# EAGLE design Motor (EAGLE 9.7.0)

## Sheet 1 of 2
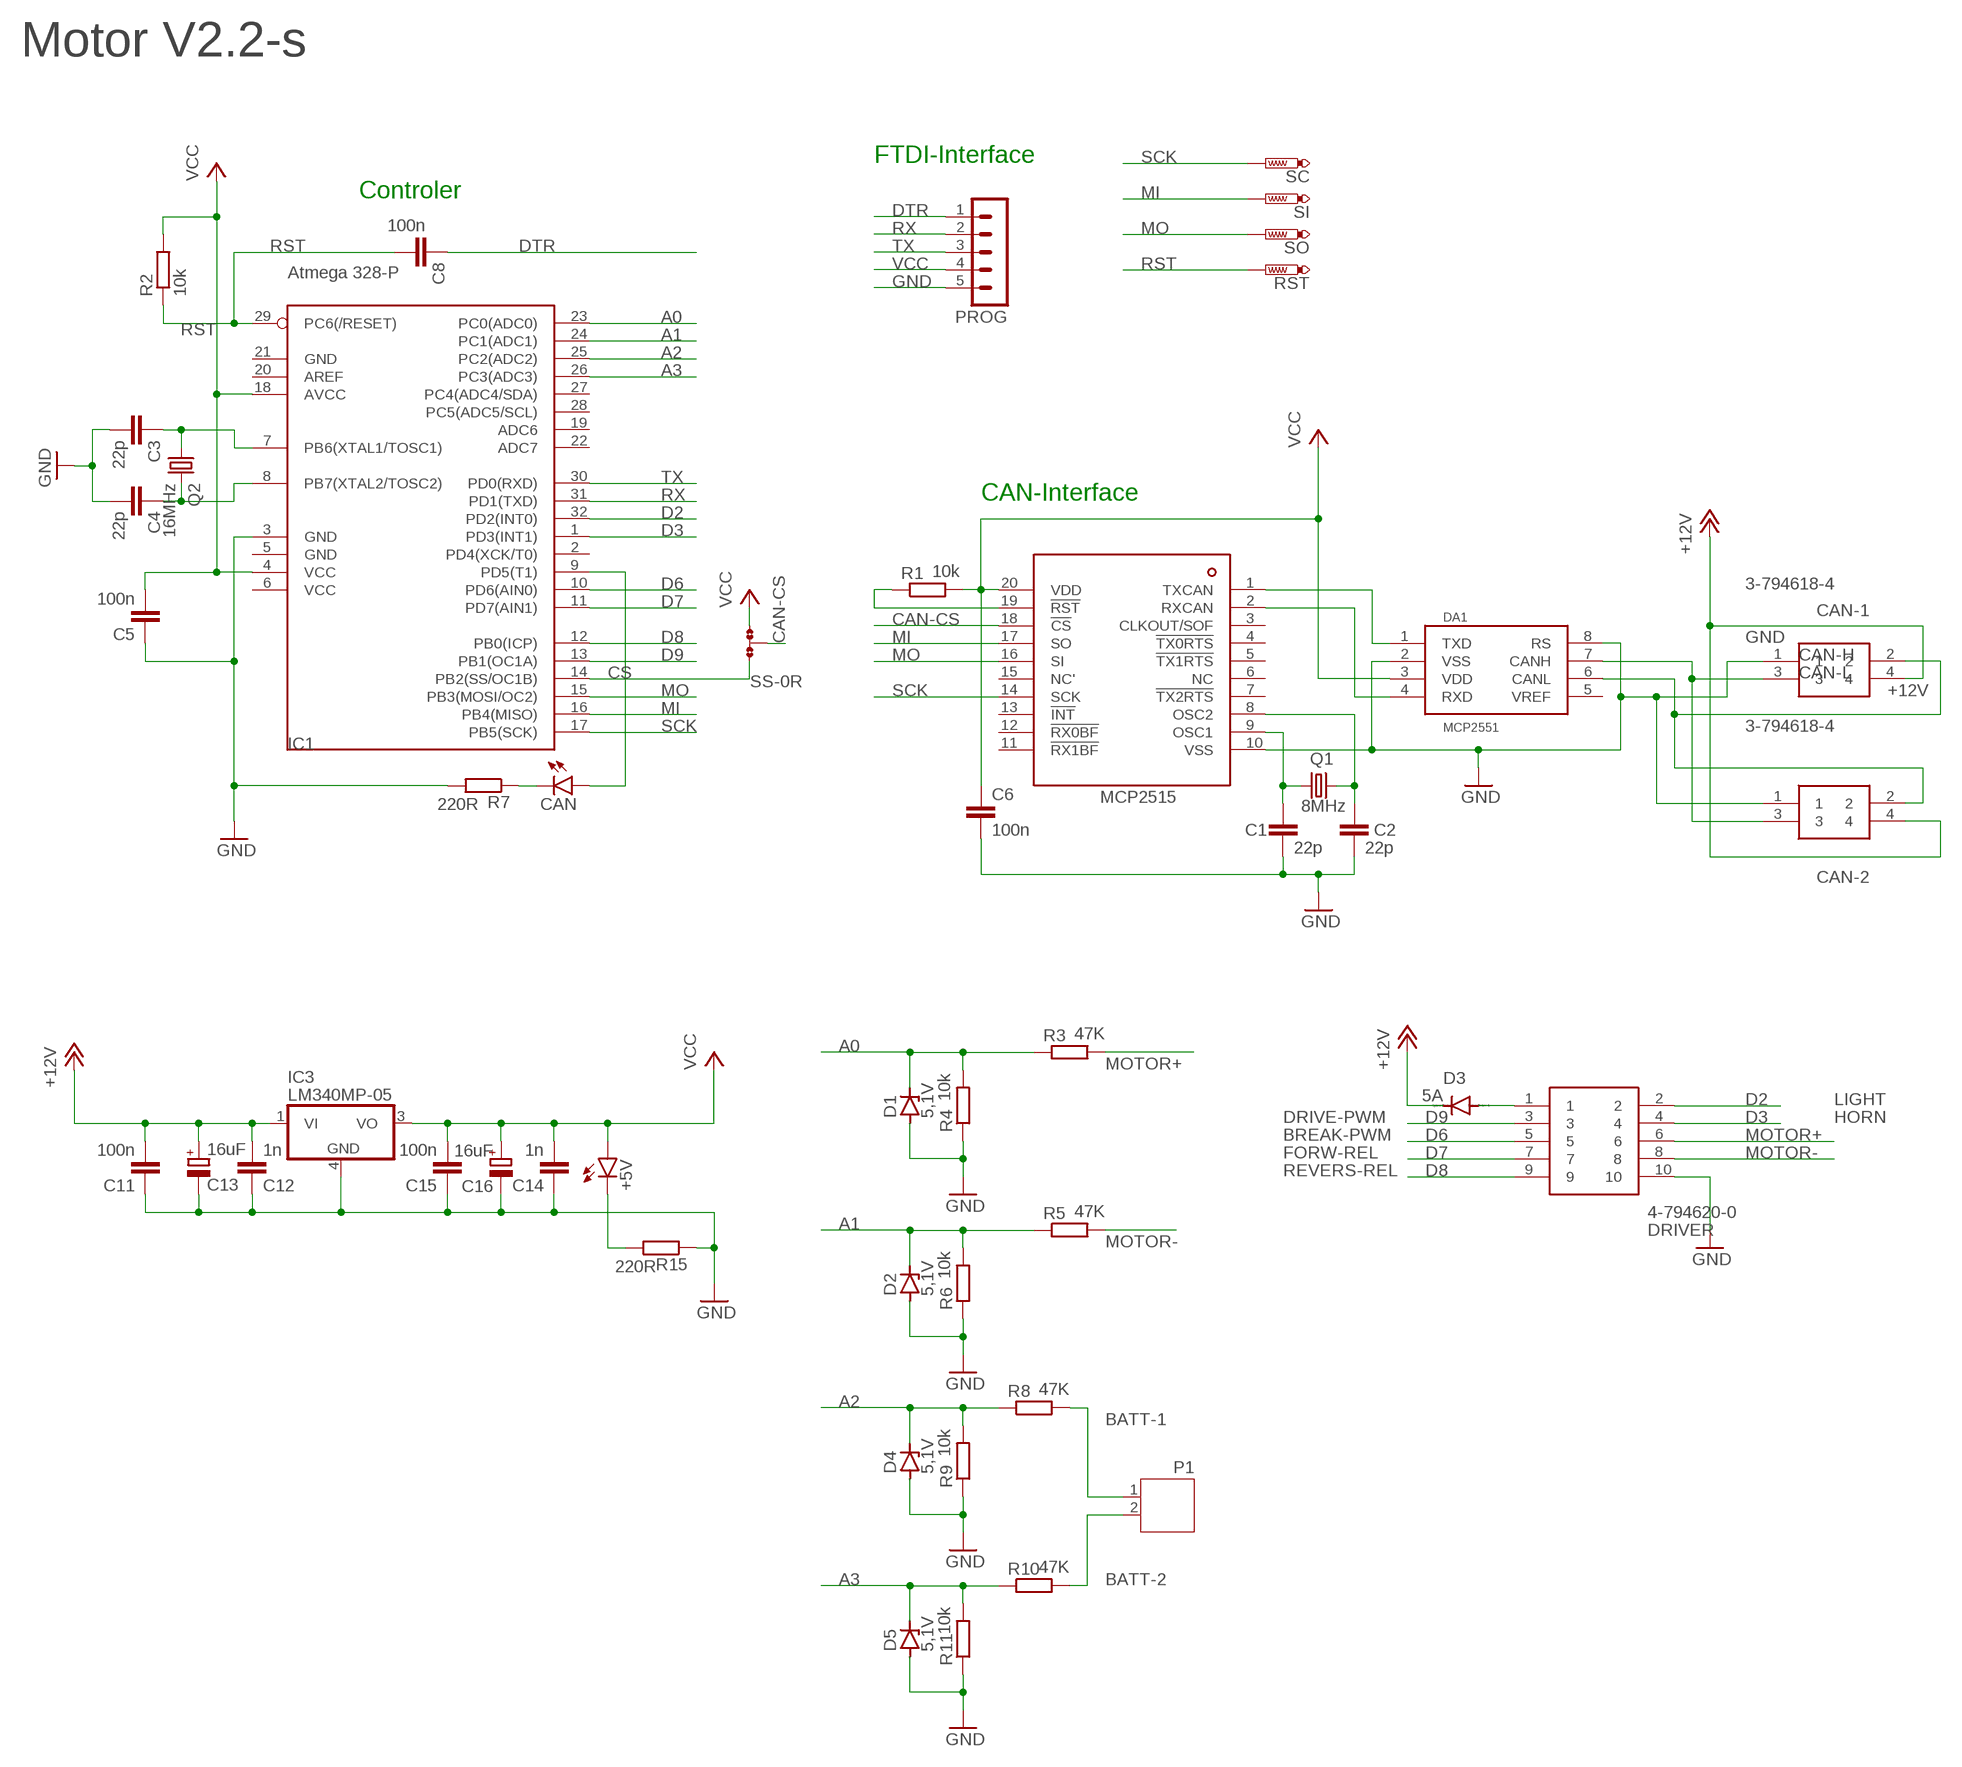
[diagram p0: schematic, sheet 1]

### Parts
+5V  LEDCHIP-LED0603  [CHIP-LED0603]
C1  22p  C-EUC0402K  [C0402K]
C2  22p  C-EUC0402K  [C0402K]
C3  22p  C-EUC0402K  [C0402K]
C4  22p  C-EUC0402K  [C0402K]
C5  100n  C-EUC0402K  [C0402K]
C6  100n  C-EUC0402K  [C0402K]
C8  100n  C-EUC0402K  [C0402K]
C11  100n  C-EUC0402K  [C0402K]
C12  1n  C-EUC0402K  [C0402K]
C13  16uF  CPOL-EUA/3216-18W  [A/3216-18W]
C14  1n  C-EUC0402K  [C0402K]
C15  100n  C-EUC0402K  [C0402K]
C16  16uF  CPOL-EUA/3216-18W  [A/3216-18W]
CAN  LEDCHIP-LED0603  [CHIP-LED0603]
CAN-1  3-794618-4  [SHDRRA4W102P300_2X2_686X892X73]
CAN-2  3-794618-4  [SHDRRA4W102P300_2X2_686X892X73]
D1  5,1V  ZENER-DIODESOD80C  [SOD80C]
D2  5,1V  ZENER-DIODESOD80C  [SOD80C]
D3  5A  DIODE-DO214AA  [DO214AA]
D4  5,1V  ZENER-DIODESOD80C  [SOD80C]
D5  5,1V  ZENER-DIODESOD80C  [SOD80C]
DA1  MCP2551  TJA1050  [SO08]
DRIVER  4-794620-0  [47946200]
IC1  Atmega 328-P  MEGA8-AI  [TQFP32-08]
IC2  MCP2515  [TSSOP20]
IC3  LM340MP-05  [SOT223]
P1  JST-PH2  [JST-PH2]
PROG  MA05-1  [MA05-1]
Q1  8MHz  CRYSTALHC49S  [HC49/S]
Q2  16MHz  CRYSTALHC49S  [HC49/S]
R1  10k  R-EU_R0805  [R0805]
R2  10k  R-EU_R0805  [R0805]
R3  47K  R-EU_MELF0102W  [MINI_MELF-0102W]
R4  10k  R-EU_MELF0102W  [MINI_MELF-0102W]
R5  47K  R-EU_MELF0102W  [MINI_MELF-0102W]
R6  10k  R-EU_MELF0102W  [MINI_MELF-0102W]
R7  220R  R-EU_R0805  [R0805]
R8  47K  R-EU_MELF0102W  [MINI_MELF-0102W]
R9  10k  R-EU_MELF0102W  [MINI_MELF-0102W]
R10  47K  R-EU_MELF0102W  [MINI_MELF-0102W]
R11  10k  R-EU_MELF0102W  [MINI_MELF-0102W]
R15  220R  R-EU_R0805  [R0805]
RST  PTR1B1,27  [B1,27]
SC  PTR1B1,27  [B1,27]
SI  PTR1B1,27  [B1,27]
SO  PTR1B1,27  [B1,27]
SS  0R-JUMPA  [A0R-JMP]

### Nets
+12V: C11.2 C12.2 C13.+ CAN-1.4 CAN-2.4 D3.C IC3.1(VI)
A0: D1.C IC1.23(PC0(ADC0)) R3.1 R4.2
A1: D2.C IC1.24(PC1(ADC1)) R5.1 R6.2
A2: D4.C IC1.25(PC2(ADC2)) R8.1 R9.2
A3: D5.C IC1.26(PC3(ADC3)) R10.1 R11.2
BATT-1: P1.1 R8.2
BATT-2: P1.2 R10.2
CAN-CS: IC2.18(!CS) SS.2
CAN-H: CAN-1.3 CAN-2.3 DA1.7(CANH)
CAN-L: CAN-1.2 CAN-2.2 DA1.6(CANL)
CAN-OCC1: C1.1 IC2.9(OSC1) Q1.1
CAN-OCC2: C2.1 IC2.8(OSC2) Q1.2
CS: IC1.14(PB2(SS/OC1B)) SS.3
D2: DRIVER.2 IC1.32(PD2(INT0))
D3: DRIVER.4 IC1.1(PD3(INT1))
D6: DRIVER.5 IC1.10(PD6(AIN0))
D7: DRIVER.7 IC1.11(PD7(AIN1))
D8: DRIVER.9 IC1.12(PB0(ICP))
D9: DRIVER.3 IC1.13(PB1(OC1A))
DTR: C8.1 PROG.1
GND: C1.2 C2.2 C3.2 C4.2 C5.1 C6.2 C11.1 C12.1 C13.- C14.1 C15.1 C16.- CAN-1.1 CAN-2.1 D1.A D2.A D4.A D5.A DA1.2(VSS) DA1.8(RS) DRIVER.10 IC1.3(GND) IC2.10(VSS) IC3.4(GND) PROG.5 R4.1 R6.1 R7.2 R9.1 R11.1 R15.1
MI: IC1.16(PB4(MISO)) IC2.17(SO) SI.TP
MO: IC1.15(PB3(MOSI/OC2)) IC2.16(SI) SO.TP
MOTOR+: DRIVER.6 R3.2
MOTOR-: DRIVER.8 R5.2
N$1: D3.A DRIVER.1
N$2: CAN.C R7.1
N$3: CAN.A IC1.9(PD5(T1))
N$6: IC2.19(!RST) R1.1
N$10: C3.1 IC1.7(PB6(XTAL1/TOSC1)) Q2.1
N$11: C4.1 IC1.8(PB7(XTAL2/TOSC2)) Q2.2
N$12: +5V.C R15.2
RST: C8.2 IC1.29(PC6(/RESET)) R2.1 RST.TP
RX: IC1.31(PD1(TXD)) PROG.2
RXCAN: DA1.4(RXD) IC2.2(RXCAN)
SCK: IC1.17(PB5(SCK)) IC2.14(SCK) SC.TP
TX: IC1.30(PD0(RXD)) PROG.3
TXCAN: DA1.1(TXD) IC2.1(TXCAN)
VCC: +5V.A C5.2 C6.1 C14.2 C15.2 C16.+ DA1.3(VDD) IC1.4(VCC) IC1.18(AVCC) IC2.20(VDD) IC3.3(VO) PROG.4 R1.2 R2.2 SS.1
Unconnected: DA1.5(VREF) IC1.2(PD4(XCK/T0)) IC1.19(ADC6) IC1.20(AREF) IC1.22(ADC7) IC1.27(PC4(ADC4/SDA)) IC1.28(PC5(ADC5/SCL)) IC2.3(CLKOUT/SOF) IC2.4(!TX0RTS) IC2.5(!TX1RTS) IC2.6(NC) IC2.7(!TX2RTS) IC2.11(!RX1BF) IC2.12(!RX0BF) IC2.13(!INT) IC2.15(NC')

### Notes on the sheet
- Motor V2.2-s
- FTDI-Interface
- Controler
- CAN-Interface
- LIGHT
- DRIVE-PWM | HORN
- BREAK-PWM
- FORW-REL
- REVERS-REL

## Sheet 2 of 2

## Power pins joined to a net without a drawn wire
GND: IC1.5(GND) IC1.21(GND)
VCC: IC1.6(VCC)

## Library data of the parts
+5V CAN = led:LED: LED OSRAM: - CHIPLED LG R971, LG N971, LY N971, LG Q971, LY Q971, LO R971, LY R971 LH N974, LH R974 LS Q976, LO Q976, LY Q976 LO Q996 - Hyper CHIPLED LW Q18S LB Q993, LB Q99A, LB R99A - SideLED LS A670, LO A670, LY A670, LG A670, LP A670 LB A673, LV A673, LT A673, LW A673 LH A674 LY A675 LS A676, LA A676, LO A676, LY A676, LW A676 LS A679, LY A679, LG A679 - Hyper Micro SIDELED® LS Y876, LA Y876, LO Y876, LY Y876 LT Y87S - SmartLED LW L88C, LW L88S LB L89C, LB L89S, LG L890 LS L89K, LO L89K, LY L89K LS L896, LA L896, LO L896, LY L896 - TOPLED LS T670, LO T670, LY T670, LG T670, LP T670 LSG T670, LSP T670, LSY T670, LOP T670, LYG T670 LG T671, LOG T671, LSG T671 LB T673, LV T673, LT T673, LW T673 LH T674 LS T676, LA T676, LO T676, LY T676, LB T676, LH T676, LSB T676, LW T676 LB T67C, LV T67C, LT T67C, LS T67K, LO T67K, LY T67K, LW E67C LS E67B, LA E67B, LO E67B, LY E67B, LB E67C, LV E67C, LT E67C LW T67C LS T679, LY T679, LG T679 LS T770, LO T770, LY T770, LG T770, LP T770 LB T773, LV T773, LT T773, LW T773 LH T774 LS E675, LA E675, LY E675, LS T675 LS T776, LA T776, LO T776, LY T776, LB T776 LHGB T686 LT T68C, LB T68C - Hyper Mini TOPLED® LB M676 - Mini TOPLED Santana® LG M470 LS M47K, LO M47K, LY M47K Source: http://www.osram.convergy.de LUXEON: - LUMILED® LXK2-PW12-R00, LXK2-PW12-S00, LXK2-PW14-U00, LXK2-PW14-V00 LXK2-PM12-R00, LXK2-PM12-S00, LXK2-PM14-U00 LXK2-PE12-Q00, LXK2-PE12-R00, LXK2-PE12-S00, LXK2-PE14-T00, LXK2-PE14-U00 LXK2-PB12-K00, LXK2-PB12-L00, LXK2-PB12-M00, LXK2-PB14-N00, LXK2-PB14-P00, LXK2-PB14-Q00 LXK2-PR12-L00, LXK2-PR12-M00, LXK2-PR14-Q00, LXK2-PR14-R00 LXK2-PD12-Q00, LXK2-PD12-R00, LXK2-PD12-S00 LXK2-PH12-R00, LXK2-PH12-S00 LXK2-PL12-P00, LXK2-PL12-Q00, LXK2-PL12-R00 Source: www.luxeon.com KINGBRIGHT: KA-3528ASYC Source: www.kingbright.com
C1-C6 C8 C11 C12 C14 C15 = rcl:C-EU: CAPACITOR, European symbol; SPICEPREFIX: C
C13 C16 = rcl:CPOL-EU: POLARIZED CAPACITOR, European symbol; SPICEPREFIX: C
CAN-1 CAN-2 = SamacSys_Parts:3-794618-4: 4 way 2 row r/a header Mate-N-Lok Source: Datasheet <https://rs.componentsearchengine.com/Datasheets/2/3-794618-4.pdf>; DESCRIPTION: 4 way 2 row r/a header Mate-N-Lok; HEIGHT: 7.37mm; MANUFACTURER_NAME: TE Connectivity; MANUFACTURER_PART_NUMBER: 3-794618-4
D1 D2 D4 D5 = diode:ZENER-DIODE: Z-Diode
D3 = diode:DIODE-: DIODE
DA1 = TJA1050:TJA1050: High speed CAN transceiver Input levels compatible with 3.3 V and 5 V devices 5V supply
DRIVER = 4-794620-0:4-794620-0: Pin & Socket Connectors HDR R/A 10 POS 30 AU DUAL Source: Datasheet <https://media.digikey.com/pdf/Data Sheets/Tyco Electonics AMP PDFs/794620.pdf>; ARROW_PART_NUMBER: 4-794620-0; ARROW_PRICE-STOCK: https://www.arrow.com/en/products/4-794620-0/te-connectivity; DESCRIPTION: Pin & Socket Connectors HDR R/A 10 POS 30 AU DUAL; HEIGHT: 10.88mm; MANUFACTURER_NAME: TE Connectivity; MANUFACTURER_PART_NUMBER: 4-794620-0; MOUSER_PART_NUMBER: 571-4-794620-0; MOUSER_PRICE-STOCK: https://www.mouser.co.uk/ProductDetail/TE-Connectivity-AMP/4-794620-0?qs=Rd%252BN518myCzN0bYIsEmaSQ%3D%3D
IC1 = atmel:MEGA8: MICROCONTROLLER 8 Kbytes FLASH, 1 kbytes SRAM, 512 bytes EEPROM, USART, 6-channel 10 bit ADC, 2-channel 8 bit ADC Pin compatible with Atmega48, ATMega88, ATMega168 Source: avr.lbr; MPN: ATMEGA8-16AU; OC_FARNELL: 9171371; OC_NEWARK: 73M8863
IC2 = mcp2514:MCP2515: Microchip Technology’s MCP2515 is a stand-alone Controller Area Network (CAN) controller that implements the CAN specification, version 2.0B. It is capable of transmitting and receiving both standard and extended data and remote frames. The MCP2515 has two acceptance masks and six acceptance filters that are used to filter out unwanted messages, thereby reducing the host MCUs overhead. The MCP2515 interfaces with microcontrollers (MCUs) via an industry standard Serial Peripheral Interface (SPI).
IC3 = linear:LM340?-*: Positive VOLTAGE REGULATOR Source: http://cache.national.com/ds/LM/LM340.pdf
P1 = jst-ph:JST-PH2
PROG = con-lstb:MA05-1: PIN HEADER; OC_FARNELL: unknown; OC_NEWARK: unknown
Q1 Q2 = crystal:CRYSTAL: CRYSTAL; OC_FARNELL: 1667008; OC_NEWARK: unknown
R1-R11 R15 = rcl:R-EU_: RESISTOR, European symbol; SPICEPREFIX: R
RST SC SI SO = testpad:PTR1: TEST PIN
SS = jump-0r-smd:0R-JUMP: SMD 0R 0805 Jumper

## Board
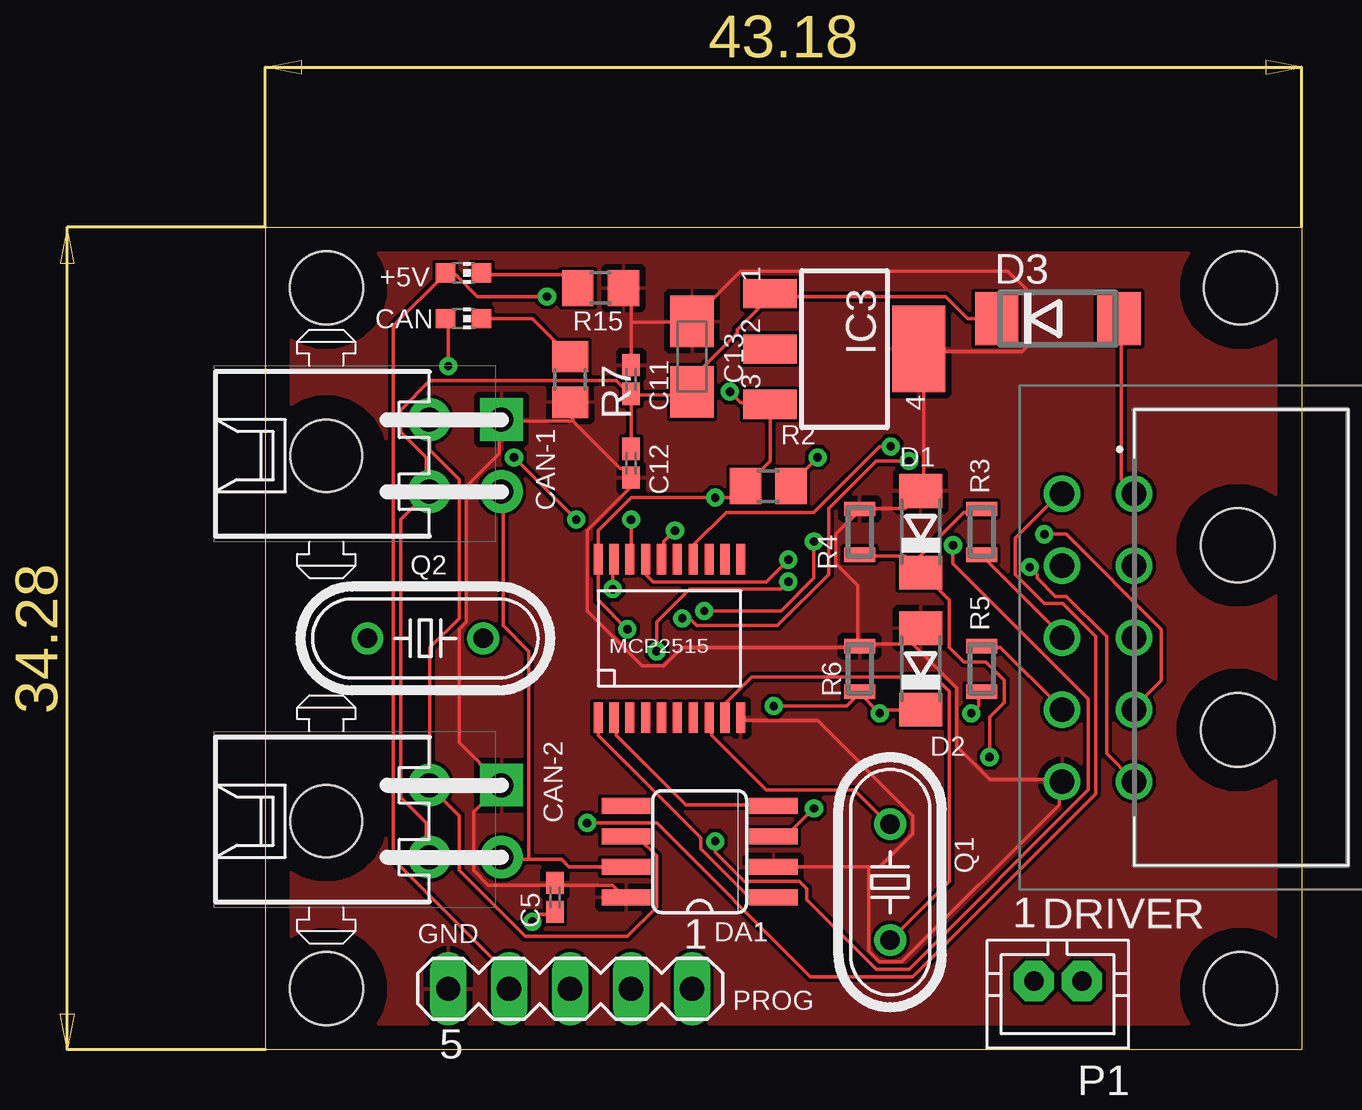
[diagram p1: board, top side]
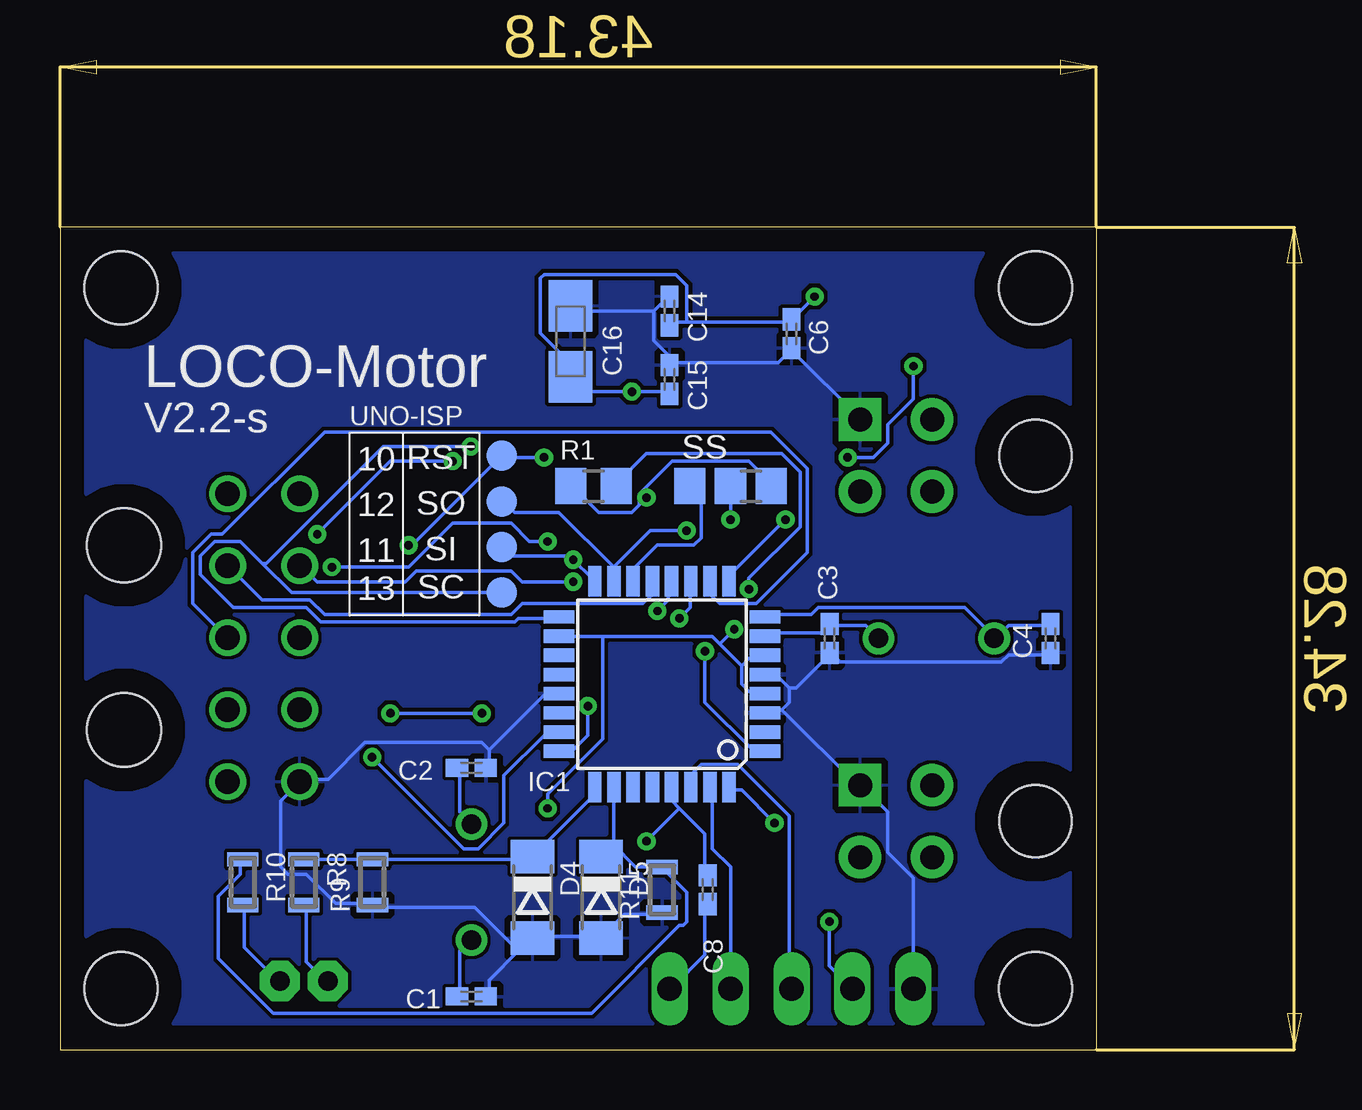
[diagram p2: board, bottom side, seen from below]

Size 43.18 x 34.29 mm. Coordinates in mm from the lower left corner, seen from the top.
Outline: 0,34.29 0,0 43.18,0 43.18,34.29 0,34.29
Copper layers (1*16): Top / Bottom
Stack-up Default Layer Stack: Top User Defined 0.035mm / Dielectric-1 User Defined 1.5mm / Bottom User Defined 0.035mm
Design rules "default": minimum track width 6mil, minimum drill 0.35mm, track to track 6mil, track to pad 6mil, pad to pad 6mil, via to via 6mil, smd to smd 6mil, copper to edge 40mil, drill to drill 6mil, minimum pad ring 10mil, minimum via ring 8mil, stop-mask expansion 4mil, vias tented up to drill 0mil, thermal gap 10mil
Holes 3.05 mm at 2.54,2.54 2.54,31.75 40.64,31.75 40.64,2.54

### Footprints (pad centres in the part's own frame; a part is rotated, then mirrored left to right if it is on the bottom)
CHIP-LED0603 = smd 0.8 x 0.8: A 0,-0.75; C 0,0.75
C0402K = smd 0.925 x 0.74: 1 -0.6,0; 2 0.6,0
A/3216-18W = smd 2.15 x 1.8: + 1.475,0; - -1.475,0
SHDRRA4W102P300_2X2_686X892X73 = drill 1 pad 1.778 square: 1 1.5,-7.3 | drill 1 pad 1.778: 2 1.5,-4.3; 3 -1.5,-7.3; 4 -1.5,-4.3 | hole 3: 0,0
SOD80C = smd 1.4 x 1.8: A 1.7,0; C -1.7,0
DO214AA = smd 1.8 x 2.2: A 2.55,0; C -2.55,0
SO08 = smd 0.66 x 2.032: 1 -1.905,-3.073; 2 -0.635,-3.073; 3 0.635,-3.073; 4 1.905,-3.073; 5 1.905,3.073; 6 0.635,3.073; 7 -0.635,3.073; 8 -1.905,3.073
47946200 = drill 1.02 pad 1.53: 1 0,0; 2 0,3; 3 -3,0; 4 -3,3; 5 -6,0; 6 -6,3; 7 -9,0; 8 -9,3; 9 -12,0; 10 -12,3 | hole 3.08: -9.85,-4.32; -2.15,-4.32
TQFP32-08 = smd 1.27 x 0.559: 1 -4.293,2.8; 2 -4.293,2; 3 -4.293,1.2; 4 -4.293,0.4; 5 -4.293,-0.4; 6 -4.293,-1.2; 7 -4.293,-2; 8 -4.293,-2.8; 17 4.293,-2.8; 18 4.293,-2; 19 4.293,-1.2; 20 4.293,-0.4; 21 4.293,0.4; 22 4.293,1.2; 23 4.293,2; 24 4.293,2.8 | smd 0.559 x 1.27: 9 -2.8,-4.293; 10 -2,-4.293; 11 -1.2,-4.293; 12 -0.4,-4.293; 13 0.4,-4.293; 14 1.2,-4.293; 15 2,-4.293; 16 2.8,-4.293; 25 2.8,4.293; 26 2,4.293; 27 1.2,4.293; 28 0.4,4.293; 29 -0.4,4.293; 30 -1.2,4.293; 31 -2,4.293; 32 -2.8,4.293
TSSOP20 = smd 1.27 x 0.381: 1 -3.302,2.642; 2 -3.302,1.981; 3 -3.302,1.321; 4 -3.302,0.66; 5 -3.302,0; 6 -3.302,-0.66; 7 -3.302,-1.321; 8 -3.302,-1.981; 9 -3.302,-2.642; 10 -3.302,-3.302; 11 3.302,-3.302; 12 3.302,-2.642; 13 3.302,-1.981; 14 3.302,-1.321; 15 3.302,-0.66; 16 3.302,0; 17 3.302,0.66; 18 3.302,1.321; 19 3.302,1.981; 20 3.302,2.642
SOT223 = smd 1.219 x 2.235: 1 -2.311,-3.099; 2 0,-3.099; 3 2.311,-3.099 | smd 3.6 x 2.2: 4 0,3.099
JST-PH2 = drill 0.813 pad 1.676 octagon: 1 1,0; 2 -1,0
MA05-1 = drill 1.016 long: 1 -5.08,0; 2 -2.54,0; 3 0,0; 4 2.54,0; 5 5.08,0
HC49/S = drill 0.813: 1 -2.413,0; 2 2.413,0
R0805 = smd 1.3 x 1.5: 1 -0.95,0; 2 0.95,0
MINI_MELF-0102W = smd 0.6 x 1.3: 1 -0.95,0; 2 0.95,0
B1,27 = smd 1.27 x 1.27: TP 0,0
A0R-JMP = smd 1.5 x 1.3: 1 0,1.7; 2 0,0; 3 0,-1.7

### Placement (x,y rotation side)
+5V  8.26,32.38 270 top
C1  26.04,2.22 0 bottom
C2  26.04,11.75 0 bottom
C3  11.11,17.14 270 bottom
C4  1.91,17.14 270 bottom
C5  12.06,6.35 270 top
C6  12.7,29.84 270 bottom
C8  16.19,6.67 90 bottom
C11  15.24,27.94 270 top
C12  15.24,24.45 90 top
C13  17.78,28.89 270 top
C14  17.78,30.8 270 bottom
C15  17.78,27.94 270 bottom
C16  21.91,29.53 270 bottom
CAN  8.26,30.48 270 top
CAN-1  2.54,24.77 90 top
CAN-2  2.54,9.53 90 top
D1  27.3,21.59 90 top
D2  27.3,15.88 90 top
D3  33.02,30.48 0 top
D4  23.5,6.35 270 bottom
D5  20.64,6.35 270 bottom
DA1  18.1,8.26 90 top
DRIVER  36.2,23.18 90 top
IC1  18.1,15.24 180 bottom
IC2  16.51,17.14 90 top
IC3  24.13,29.21 270 top
P1  33.02,2.86 180 top
PROG  12.7,2.54 180 top
Q1  26.04,6.99 90 top
Q2  6.67,17.14 180 top
R1  20.95,23.5 180 bottom
R2  20.95,23.5 180 top
R3  29.84,21.59 270 top
R4  24.77,21.59 270 top
R5  29.84,15.88 90 top
R6  24.77,15.88 270 top
R7  12.7,27.94 270 top
R8  33.02,6.99 270 bottom
R9  30.16,6.99 90 bottom
R10  35.56,6.99 270 bottom
R11  18.1,6.67 90 bottom
R15  13.97,31.75 180 top
RST  24.77,24.77 0 bottom
SC  24.77,19.05 0 bottom
SI  24.77,20.95 0 bottom
SO  24.77,22.86 0 bottom
SS  15.24,23.5 270 bottom

### Tracks (layer width: path | path; a pad name or v marks a point on that pad's centre or on a via)
+12V
  Top 0.152: CAN-2.4 6.71,8.08 6.71,9.45 5.64,10.52 5.64,22.1 6.71,23.16 CAN-1.4 6.71,23.32 6.71,24.69 5.64,25.76 5.64,26.67 6.86,27.89 14.63,27.89 15.24,27.28 | 15.24,27.28 C12.2 | 15.24,27.28 17.68,27.28 C13.+ 17.83,27.43 17.83,28.04 19.66,29.87 19.66,30.02 21.03,31.39 | D3.C 29.26,30.48 28.35,31.39 21.03,31.39 | 21.03,31.39 IC3.1 | 15.24,27.28 C11.2
A0  (via drill 0.35)
  Top 0.152: v30.18,12.19 30.18,13.87 30.79,14.48 30.79,15.39 30.02,16.15 29.11,16.15 28.5,16.76 28.5,18.75 27.43,19.81 D1.C | 26.98,20.27 27.28,19.96 D1.C | 26.98,20.27 26.67,20.57 24.84,20.57 R4.2 | 26.98,20.27 29.11,22.4 29.72,22.4 R3.1 | 26.98,20.27 D1.C
  Bottom 0.152: v30.18,12.19 26.36,8.38 25.76,8.38 24.69,9.45 24.69,11.43 23.01,13.11 22.4,13.11 IC1.23
A1  (via drill 0.35)
  Top 0.152: v21.18,14.33 24.23,14.33 24.69,14.78 R6.2 24.84,14.78 25.45,14.17 | v29.41,14.02 29.72,14.33 29.72,14.78 R5.1 | 25.45,14.17 27.28,14.17 D2.C | 25.45,14.17 v25.6,14.02
  Bottom 0.152: v21.18,14.33 21.18,13.11 21.79,12.5 22.25,12.5 IC1.24 | v25.6,14.02 v29.41,14.02
A2
  Bottom 0.152: R8.1 32.92,7.92 30.18,7.92 R9.2 30.02,7.92 23.62,7.92 D4.C 23.47,8.08 21.03,10.52 21.03,10.82 IC1.25
A3
  Bottom 0.152: 20.12,8.53 20.12,10.82 IC1.26 | 20.12,8.53 20.57,8.08 D5.C 20.12,8.53 | 20.12,8.53 19.2,7.62 18.14,7.62 R11.2 17.98,7.47 17.07,6.55 17.07,5.33 17.22,5.18 17.37,5.18 21.03,1.52 34.29,1.52 36.58,3.81 36.58,6.4 35.66,7.32 35.66,7.92 R10.1
BATT-1
  Bottom 0.152: R8.2 32.92,5.94 32.92,3.66 32.16,2.9 P1.1
BATT-2
  Bottom 0.152: R10.2 35.51,5.94 35.51,4.27 34.14,2.9 P1.2
CAN-CS  (via drill 0.35)
  Top 0.152: v15.24,22.1 15.24,20.57 IC2.18
  Bottom 0.152: SS.2 v15.24,22.1
CAN-H
  Top 0.152: DA1.7 12.65,7.62 12.34,7.92 10.97,7.92 | 10.97,7.92 9.91,7.92 CAN-2.3 | 10.97,7.92 10.97,16.61 9.91,17.68 9.91,23.16 CAN-1.3
CAN-L
  Top 0.152: DA1.6 15.09,8.84 15.54,8.84 16.31,8.08 16.31,5.94 15.09,4.72 10.82,4.72 8.08,7.47 8.08,9.75 6.86,10.97 CAN-2.2 6.86,11.12 6.86,16.76 8.08,17.98 8.08,23.77 6.86,24.99 6.86,26.21 CAN-1.2
CAN-OCC1
  Top 0.152: IC2.9 19.2,13.87 19.2,14.48 20.27,15.54 27.89,15.54 28.5,14.94 28.5,7.01 26.06,4.57 Q1.1
  Bottom 0.152: C1.1 26.52,2.29 26.52,4.12 26.06,4.57 Q1.1
CAN-OCC2
  Top 0.152: IC2.8 18.59,13.72 18.59,13.11 20.88,10.82 24.54,10.82 25.91,9.45 Q1.2
  Bottom 0.152: C2.1 26.52,11.73 26.52,9.91 26.06,9.45 Q1.2
CS
  Bottom 0.152: IC1.14 19.2,19.66 19.2,20.12 18.29,21.03 16.76,21.03 16.46,21.34 16.46,23.01 16.92,23.47 SS.3
D2  (via drill 0.35)
  Top 0.152: v13.41,9.45 16.31,9.45 22.71,3.05 26.98,3.05 34.59,10.67 34.59,17.22 33.22,18.59 32.46,18.59 31.24,19.81 31.24,21.34 33.07,23.16 DRIVER.2
  Bottom 0.152: v13.41,9.45 14.78,10.82 15.24,10.82 IC1.32
D3  (via drill 0.35)
  Top 0.152: v16.31,16.61 16.31,17.83 17.68,19.2 21.49,19.2 v21.79,19.51
  Bottom 0.152: v16.31,16.61 16.31,14.48 14.33,12.5 13.87,12.5 IC1.1 | v21.79,19.51 23.93,19.51 24.38,19.96 28.35,19.96 28.8,19.51 32.46,19.51 33.07,20.12 DRIVER.4
D6
  Bottom 0.152: IC1.10 16,19.51 16,18.9 15.7,18.59 14.17,18.59 12.04,20.73 12.04,24.23 13.56,25.76 32.16,25.76 36.42,21.49 36.88,21.49 37.64,20.73 37.64,18.59 36.27,17.22 DRIVER.5
D7  (via drill 0.35)
  Top 0.152: v17.37,17.98 17.68,17.98 17.98,17.68 21.34,17.68 23.47,19.81 23.47,22.55 25.45,24.54 v26.82,24.54 | v32.46,21.49 33.38,21.49 37.34,17.53 37.34,15.39 36.27,14.33 DRIVER.7
  Bottom 0.152: v17.37,17.98 16.92,18.44 16.92,19.51 IC1.11 | v26.82,24.54 29.41,24.54 v32.46,21.49
D8  (via drill 0.35)
  Top 0.152: v18.29,18.29 21.49,18.29 22.86,19.66 v22.86,21.18 | v31.85,20.12 32.16,19.81 32.16,19.66 32.92,18.9 33.38,18.9 35.05,17.22 35.05,12.34 36.12,11.28 DRIVER.9
  Bottom 0.152: v18.29,18.29 17.83,18.75 17.83,19.51 IC1.12 | v22.86,21.18 23.62,21.18 24.38,21.95 26.82,21.95 28.65,20.12 v31.85,20.12
D9
  Bottom 0.152: IC1.13 18.59,19.51 18.59,18.9 18.9,18.59 23.93,18.59 24.38,18.14 32.16,18.14 32.77,18.75 34.75,18.75 36.12,20.12 DRIVER.3
DTR
  Bottom 0.152: C8.1 16.31,5.94 16.31,3.96 17.68,2.59 PROG.1
GND
  Top 0.152: DA1.2 25.15,7.62 | 25.15,7.62 25.6,7.62 26.98,8.99 26.98,9.75 23.01,13.72 19.81,13.72 IC2.10 | 25.15,7.62 25.15,4.12 25.6,3.66 26.52,3.66 33.07,10.21 33.07,11.12 DRIVER.10 33.07,11.28 30.18,11.28 28.8,12.65 28.8,15.09 26.82,17.07 | 26.82,17.07 27.28,17.53 D2.A 26.82,17.07 | 26.82,17.07 26.67,16.92 24.84,16.92 R6.1 | R6.1 24.69,16.92 24.69,19.36 23.77,20.27 23.77,21.49 24.69,22.4 R4.1 24.84,22.55 26.67,22.55 27.28,23.16 D1.A 27.43,23.32 27.43,29.11 | 15.24,30.33 15.24,31.39 14.94,31.7 R15.1 | 15.24,30.33 C11.1 | 15.24,30.33 17.68,30.33 C13.- 17.83,30.48 19.81,32.46 30.94,32.46 31.7,31.7 31.7,29.26 31.55,29.11 27.43,29.11 | 27.43,29.11 27.28,29.11 IC3.4 27.43,29.11 | 12.8,26.21 14.78,24.23 14.94,24.23 15.24,23.93 C12.1 15.24,23.47 13.41,21.64 13.41,18.29 15.7,16 16.61,16 17.37,16.76 24.69,16.76 R6.1 | 12.8,26.21 12.8,26.98 R7.2 | 12.8,26.21 9.91,26.21 CAN-1.1 9.75,26.21 9.75,24.84 8.38,23.47 8.38,17.83 8.08,17.53 8.08,12.8 9.75,11.12 CAN-2.1 9.75,10.97 8.69,9.91 8.69,7.47 9.3,6.86 12.04,6.86 C5.1 12.19,6.86 14.48,6.86 14.94,6.4 DA1.8
  Bottom 0.152: R11.1 18.14,5.64 19.66,5.64 20.57,4.72 D5.A 20.73,4.72 23.47,4.72 D4.A | 24.08,4.12 23.62,4.57 D4.A | 24.08,4.12 25.3,2.9 25.3,2.29 C1.2 | 24.08,4.12 25.91,5.94 30.02,5.94 R9.1 30.18,6.1 31.7,6.1 32.92,7.32 33.68,7.32 33.98,7.62 33.98,10.36 33.22,11.12 DRIVER.10 33.07,11.28 32,11.28 30.48,12.8 25.6,12.8 25.3,12.5 | 24.08,4.12 D4.A | 25.3,12.5 25.3,11.89 C2.2 | 25.3,12.5 23.01,14.78 22.4,14.78 IC1.21 | 18.44,30.79 18.44,29.57 17.83,28.96 17.83,28.65 C15.1 17.68,28.65 13.26,28.65 12.8,29.11 C6.2 12.65,29.11 9.91,26.36 CAN-1.1 | 18.44,30.79 17.83,31.39 C14.1 | 18.44,30.79 21.64,30.79 21.79,30.94 C16.- | 13.11,14.17 13.72,14.17 IC1.3 | 13.11,14.17 12.8,14.48 12.8,15.09 | 12.8,15.09 13.26,15.54 13.72,15.54 IC1.5 | C4.2 1.98,16.46 3.66,16.46 3.96,16.15 10.67,16.15 10.97,16.46 C3.2 11.12,16.46 12.5,15.09 12.8,15.09 | PROG.5 7.62,7.16 8.69,8.23 8.69,9.91 9.75,10.97 CAN-2.1 9.91,10.97 13.11,14.17
  pour Top: 0,34.29 43.18,34.29 43.18,0 0,0
  pour Bottom: 0,34.29 43.18,34.29 43.18,0 0,0
MI  (via drill 0.35)
  Top 0.152: IC2.17 15.85,19.81 16.15,19.51 20.88,19.51 v21.79,20.42
  Bottom 0.152: SI.TP 24.38,20.57 21.95,20.57 v21.79,20.42 21.03,19.66 IC1.16
MO  (via drill 0.35)
  Top 0.152: v17.07,21.64 16.61,21.18 16.61,20.57 IC2.16
  Bottom 0.152: 20.12,20.12 20.12,19.66 IC1.15 20.12,20.12 | 20.12,20.12 22.4,22.4 24.23,22.4 24.69,22.86 SO.TP | v17.07,21.64 18.59,21.64 20.12,20.12
MOTOR+
  Top 0.152: R3.2 29.87,20.57 33.22,17.22 DRIVER.6
MOTOR-
  Top 0.152: R5.2 29.87,16.76 30.63,16.76 33.07,14.33 DRIVER.8
N$1
  Top 0.152: D3.A 35.66,30.48 35.66,23.77 36.12,23.32 DRIVER.1
N$2
  Top 0.152: CAN.C 11.12,30.48 12.65,28.96 R7.1
N$3  (via drill 0.35)
  Top 0.152: v7.62,28.5 7.62,30.48 CAN.A | v12.95,22.1 v10.36,24.69
  Bottom 0.152: v7.62,28.5 7.62,27.13 8.69,26.06 8.69,25.3 9.3,24.69 v10.36,24.69 | v12.95,22.1 15.39,19.66 IC1.9
N$6  (via drill 0.35)
  Top 0.152: v14.48,19.2 14.48,20.42 IC2.19
  Bottom 0.152: v14.48,19.2 14.48,19.66 12.34,21.79 12.34,24.08 13.11,24.84 18.75,24.84 19.96,23.62 R1.1
N$10
  Bottom 0.152: Q2.1 9.14,17.22 9.6,17.68 10.97,17.68 C3.1 11.12,17.68 11.43,17.37 13.72,17.37 IC1.7
N$11
  Bottom 0.152: C4.1 1.98,17.68 3.66,17.68 4.12,17.22 Q2.2 4.27,17.22 5.49,18.44 11.58,18.44 11.89,18.14 13.72,18.14 IC1.8
N$12
  Top 0.152: +5V.C 9.14,32.31 12.5,32.31 12.95,31.85 R15.2
RST  (via drill 0.35)
  Top 0.152: v23.01,24.69 21.95,23.62 R2.1 | v28.65,21.03 28.65,20.27 34.29,14.63 34.29,10.82 26.82,3.35 25.45,3.35 22.55,6.25 22.55,6.71 22.25,7.01 19.96,7.01 18.75,8.23 v18.75,8.69
  Bottom 0.152: v23.01,24.69 24.69,24.69 RST.TP 28.5,21.03 v28.65,21.03 | 17.37,10.06 17.68,10.36 17.68,10.82 IC1.29 | 17.37,10.06 16.31,8.99 16.31,7.32 C8.2 | 17.37,10.06 v18.75,8.69
RX
  Bottom 0.152: PROG.2 15.24,7.62 16,8.38 16,10.82 IC1.31
RXCAN
  Top 0.152: IC2.2 14.63,13.72 14.63,13.11 17.53,10.21 21.03,10.21 DA1.4
SCK  (via drill 0.35)
  Top 0.152: IC2.14 17.83,21.03 19.2,22.4 22.86,22.4 25.6,25.15 v26.06,25.15
  Bottom 0.152: 34.75,20.27 33.53,19.05 SC.TP | 34.75,20.27 35.66,21.18 36.73,21.18 37.34,20.57 37.34,19.81 35.97,18.44 32.92,18.44 32.31,17.83 24.23,17.83 24.08,17.98 22.4,17.98 IC1.17 | v26.06,25.15 29.72,25.15 34.59,20.27 34.75,20.27
TX
  Bottom 0.152: IC1.30 16.76,10.97 16.76,11.58 16.46,11.89 14.94,11.89 12.8,9.75 12.8,2.59 PROG.3
TXCAN
  Top 0.152: IC2.1 13.87,13.11 18.14,8.84 18.14,8.38 20.12,6.4 21.03,6.4 DA1.1
VCC  (via drill 0.35)
  Top 0.152: v22.86,10.06 21.79,8.99 21.18,8.99 DA1.3 | v11.12,5.33 11.43,5.64 12.04,5.64 C5.2 | v11.73,31.39 8.84,31.39 7.92,32.31 7.62,32.31 +5V.A 7.47,32.31 5.33,30.18 5.33,7.92 10.06,3.2 10.06,2.59 PROG.4 | v19.36,27.43 19.81,26.98 21.03,26.98 IC3.3 21.03,24.54 20.12,23.62 R2.2 19.96,23.47 19.51,23.01 v18.75,23.01 15.24,23.01 13.87,21.64 IC2.20 13.87,18.75 v15.09,17.53
  Bottom 0.152: 14.78,16 14.78,15.24 14.48,14.94 13.87,14.94 IC1.4 | 14.78,16 14.48,16.31 13.87,16.31 IC1.6 | 20.57,17.22 16,17.22 15.7,16.92 | 20.57,17.22 22.25,17.22 IC1.18 | 14.78,16 15.7,16.92 | v22.86,10.06 22.86,10.67 20.57,12.95 20.57,17.22 | 19.05,23.01 19.05,22.71 19.36,22.4 20.73,22.4 21.79,23.47 R1.2 | 19.05,23.01 19.05,23.16 17.68,24.54 14.48,24.54 13.56,23.62 SS.1 | v18.75,23.01 19.05,23.01 | v11.12,5.33 11.12,3.5 PROG.4 | C15.2 17.83,27.43 v19.36,27.43 21.18,27.43 21.79,28.04 C16.+ 21.95,28.19 21.95,28.65 23.16,29.87 23.16,32.16 23.01,32.31 17.53,32.31 17.07,31.85 17.07,30.33 | v11.73,31.39 12.65,30.48 C6.1 12.8,30.33 17.07,30.33 | 17.07,30.33 17.68,30.33 C14.2 | v15.09,17.53 15.7,16.92

### Text on the board
tNames: GND
bNames: LOCO-Motor | UNO-ISP | V2.2-s | 10 | 12 | 11 | 13